# EAGLE design Track-Cam (EAGLE 7.7.0)
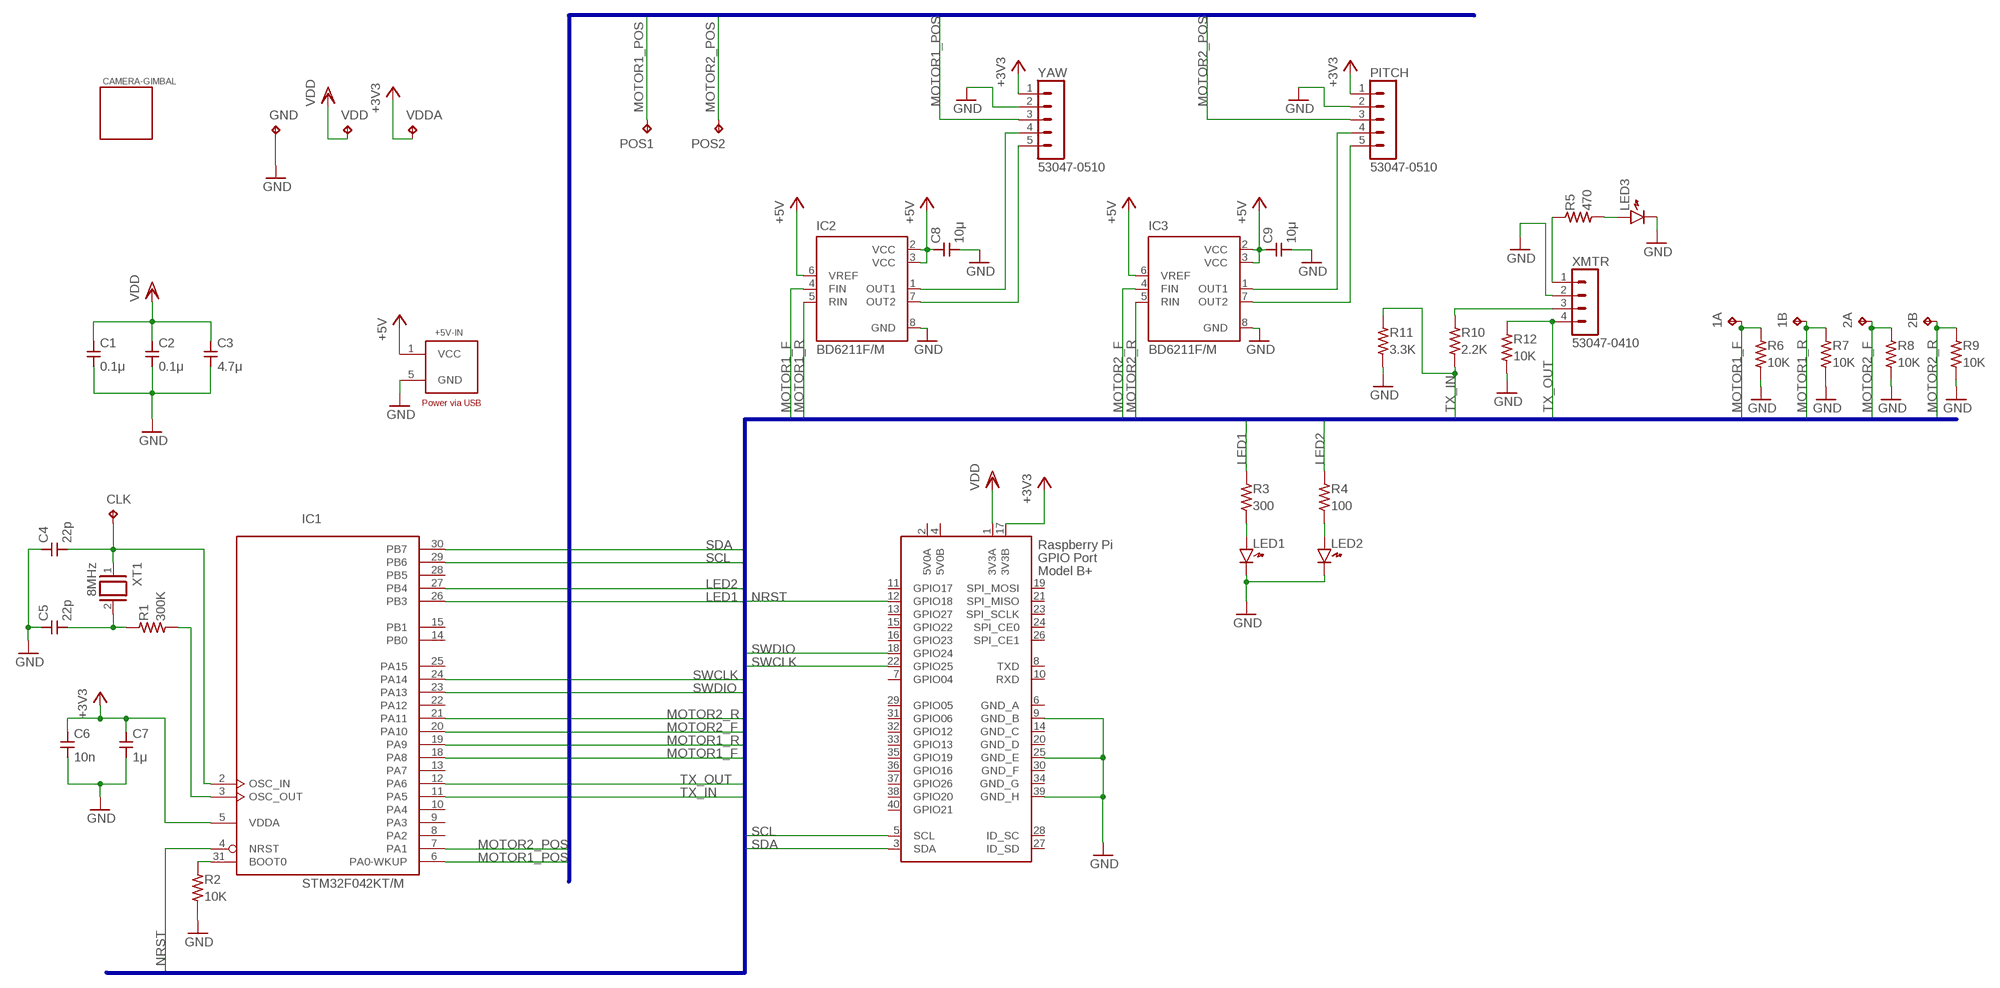
[diagram p0: schematic, sheet 1]

## Parts
1A  TPB1,27  [B1,27]
1B  TPB1,27  [B1,27]
2A  TPB1,27  [B1,27]
2B  TPB1,27  [B1,27]
+5V-IN  MRUSB-2B-D14NI-S306/M  [MICRO-USB-POWER/M]
C1  0.1μ  CAPACITOR2012  [SMD2012]
C2  0.1μ  CAPACITOR2012  [SMD2012]
C3  4.7μ  CAPACITOR2012  [SMD2012]
C4  22p  CAPACITOR1608  [SMD1608]
C5  22p  CAPACITOR1608  [SMD1608]
C6  10n  CAPACITOR2012  [SMD2012]
C7  1μ  CAPACITOR2012  [SMD2012]
C8  10μ  CAPACITOR2012  [SMD2012]
C9  10μ  CAPACITOR2012  [SMD2012]
CAMERA-GIMBAL  SG-90-CAMERA-MOUNT/NR  [SG90-CAMERA-MOUNT-NR]
CLK  TPB1,27  [B1,27]
GND  TPB1,27  [B1,27]
IC1  STM32F042KT/M  [LQFP32-M]
IC2  BD6211F/M  [SOP8/M]
IC3  BD6211F/M  [SOP8/M]
LED1  LED1608  [LED1608]
LED2  LED1608  [LED1608]
LED3  LED1608  [LED1608]
P1  RASPI_BOARD_B+#_HC  [RASPI_BOARD_B+HAT_CF]
PITCH  53047-0510  [53047-0510]
POS1  TPB1,27  [B1,27]
POS2  TPB1,27  [B1,27]
R1  300K  RESISTOR-US2012  [SMD2012]
R2  10K  RESISTOR-US2012  [SMD2012]
R3  300  RESISTOR-US2012  [SMD2012]
R4  100  RESISTOR-US2012  [SMD2012]
R5  470  RESISTOR-US2012  [SMD2012]
R6  10K  RESISTOR-US2012  [SMD2012]
R7  10K  RESISTOR-US2012  [SMD2012]
R8  10K  RESISTOR-US2012  [SMD2012]
R9  10K  RESISTOR-US2012  [SMD2012]
R10  2.2K  RESISTOR-US2012  [SMD2012]
R11  3.3K  RESISTOR-US2012  [SMD2012]
R12  10K  RESISTOR-US2012  [SMD2012]
VDD  TPB1,27  [B1,27]
VDDA  TPB1,27  [B1,27]
XMTR  53047-0410  [53047-0410]
XT1  8MHz  XTAL/S  [QS]
YAW  53047-0510  [53047-0510]

## Nets
+3V3 [power]: C6.1 C7.1 IC1.5(VDDA) P1.17(3V3B) PITCH.1 VDDA.TP YAW.1
+5V [power]: +5V-IN.1(VCC) C8.1 C9.1 IC2.2(VCC) IC2.3(VCC) IC2.6(VREF) IC3.2(VCC) IC3.3(VCC) IC3.6(VREF)
BOOT0: IC1.31(BOOT0) R2.1
GND [gnd]: +5V-IN.5(GND) C1.2 C2.2 C3.2 C4.1 C5.1 C6.2 C7.2 C8.2 C9.2 GND.TP IC2.8(GND) IC3.8(GND) LED1.K LED2.K LED3.K P1.9(GND_B) P1.25(GND_E) P1.39(GND_H) PITCH.2 R2.2 R6.2 R7.2 R8.2 R9.2 R11.2 R12.2 XMTR.2 YAW.2
LED1: IC1.26(PB3) R3.1
LED2: IC1.27(PB4) R4.1
MOTOR1+: IC2.1(OUT1) YAW.4
MOTOR1-: IC2.7(OUT2) YAW.5
MOTOR1_F: 1A.TP IC1.18(PA8) IC2.4(FIN) R6.1
MOTOR1_POS: IC1.6(PA0-WKUP) POS1.TP YAW.3
MOTOR1_R: 1B.TP IC1.19(PA9) IC2.5(RIN) R7.1
MOTOR2+: IC3.1(OUT1) PITCH.4
MOTOR2-: IC3.7(OUT2) PITCH.5
MOTOR2_F: 2A.TP IC1.20(PA10) IC3.4(FIN) R8.1
MOTOR2_POS: IC1.7(PA1) PITCH.3 POS2.TP
MOTOR2_R: 2B.TP IC1.21(PA11) IC3.5(RIN) R9.1
N$1: C5.2 R1.1 XT1.2
N$8: LED1.A R3.2
N$9: LED2.A R4.2
N$10: R5.1 XMTR.1
N$11: LED3.A R5.2
NRST: IC1.4(NRST) P1.12(GPIO18)
OSC_IN: C4.2 CLK.TP IC1.2(OSC_IN) XT1.1
OSC_OUT: IC1.3(OSC_OUT) R1.2
SCL: IC1.29(PB6) P1.5(SCL)
SDA: IC1.30(PB7) P1.3(SDA)
SWCLK: IC1.24(PA14) P1.22(GPIO25)
SWDIO: IC1.23(PA13) P1.18(GPIO24)
TX_IN: IC1.11(PA5) R10.2 R11.1
TX_IN_5V: R10.1 XMTR.3
TX_OUT: IC1.12(PA6) R12.1 XMTR.4
VDD [power]: C1.1 C2.1 C3.1 P1.1(3V3A) VDD.TP
Unconnected: IC1.8(PA2) IC1.9(PA3) IC1.10(PA4) IC1.13(PA7) IC1.14(PB0) IC1.15(PB1) IC1.22(PA12) IC1.25(PA15) IC1.28(PB5) P1.7(GPIO04) P1.8(TXD) P1.10(RXD) P1.11(GPIO17) P1.13(GPIO27) P1.15(GPIO22) P1.16(GPIO23) P1.19(SPI_MOSI) P1.21(SPI_MISO) P1.23(SPI_SCLK) P1.24(SPI_CE0) P1.26(SPI_CE1) P1.27(ID_SD) P1.28(ID_SC) P1.29(GPIO05) P1.31(GPIO06) P1.32(GPIO12) P1.33(GPIO13) P1.35(GPIO19) P1.36(GPIO16) P1.37(GPIO26) P1.38(GPIO20) P1.40(GPIO21)

## Buses
DIG[0..12]
ANA[0..1]

## Power pins joined to a net without a drawn wire
5V0A: P1.2(5V0A)
5V0B: P1.4(5V0B)
GND: IC1.16(GND) IC1.32(GND)
GND_A: P1.6(GND_A)
GND_C: P1.14(GND_C)
GND_D: P1.20(GND_D)
GND_F: P1.30(GND_F)
GND_G: P1.34(GND_G)
VDD: IC1.1(VDD) IC1.17(VDD)

## Library data of the parts
1A 1B 2A 2B CLK GND POS1 POS2 VDD VDDA = testpad:TP: Test pad
+5V-IN = connector:MRUSB-2B-D14NI-S306: Useconn Electronics Ltd. Micro USB, B type Female Solder type
C1-C9 = gen-discrete:CAPACITOR: Generic Capacitor
CAMERA-GIMBAL = mech:SG-90-CAMERA-MOUNT
IC1 = stm32:STM32F042K*T: ARM 32-bit Cortex™-M0 CPU 48 MHz maximum frequency 32 Kbytes of Flash memory 6 kbytes of SRAM 26 GPIOs 2.4 to 3.6 V application supply
IC2 IC3 = rohm-modified:BD621*F: H-bridge driver for brush motors Source: http://www.rohm.com/products/databook/motor/pdf/bd623x_series-e.pdf
LED1-LED3 = gen-discrete:LED: Generic LEDs
P1 = raspi:RASPI_BOARD_B+#: Raspberry Pi GPIO connector with markings for the outer dimensions of the Raspberry Pi board model B+ with different sets of drill holes or mounting pads All pins connected
PITCH YAW = connector:53047-0510: HEADER
R1-R12 = gen-discrete:RESISTOR-US: Generic Registor
XMTR = connector:53047-0410: HEADER
XT1 = gen-discrete:XTAL/S: CRYSTAL

## Net classes
1 gnd: width 0.61 mm, drill 0.203 mm
2 power: width 0.61 mm, drill 0.203 mm

## Board
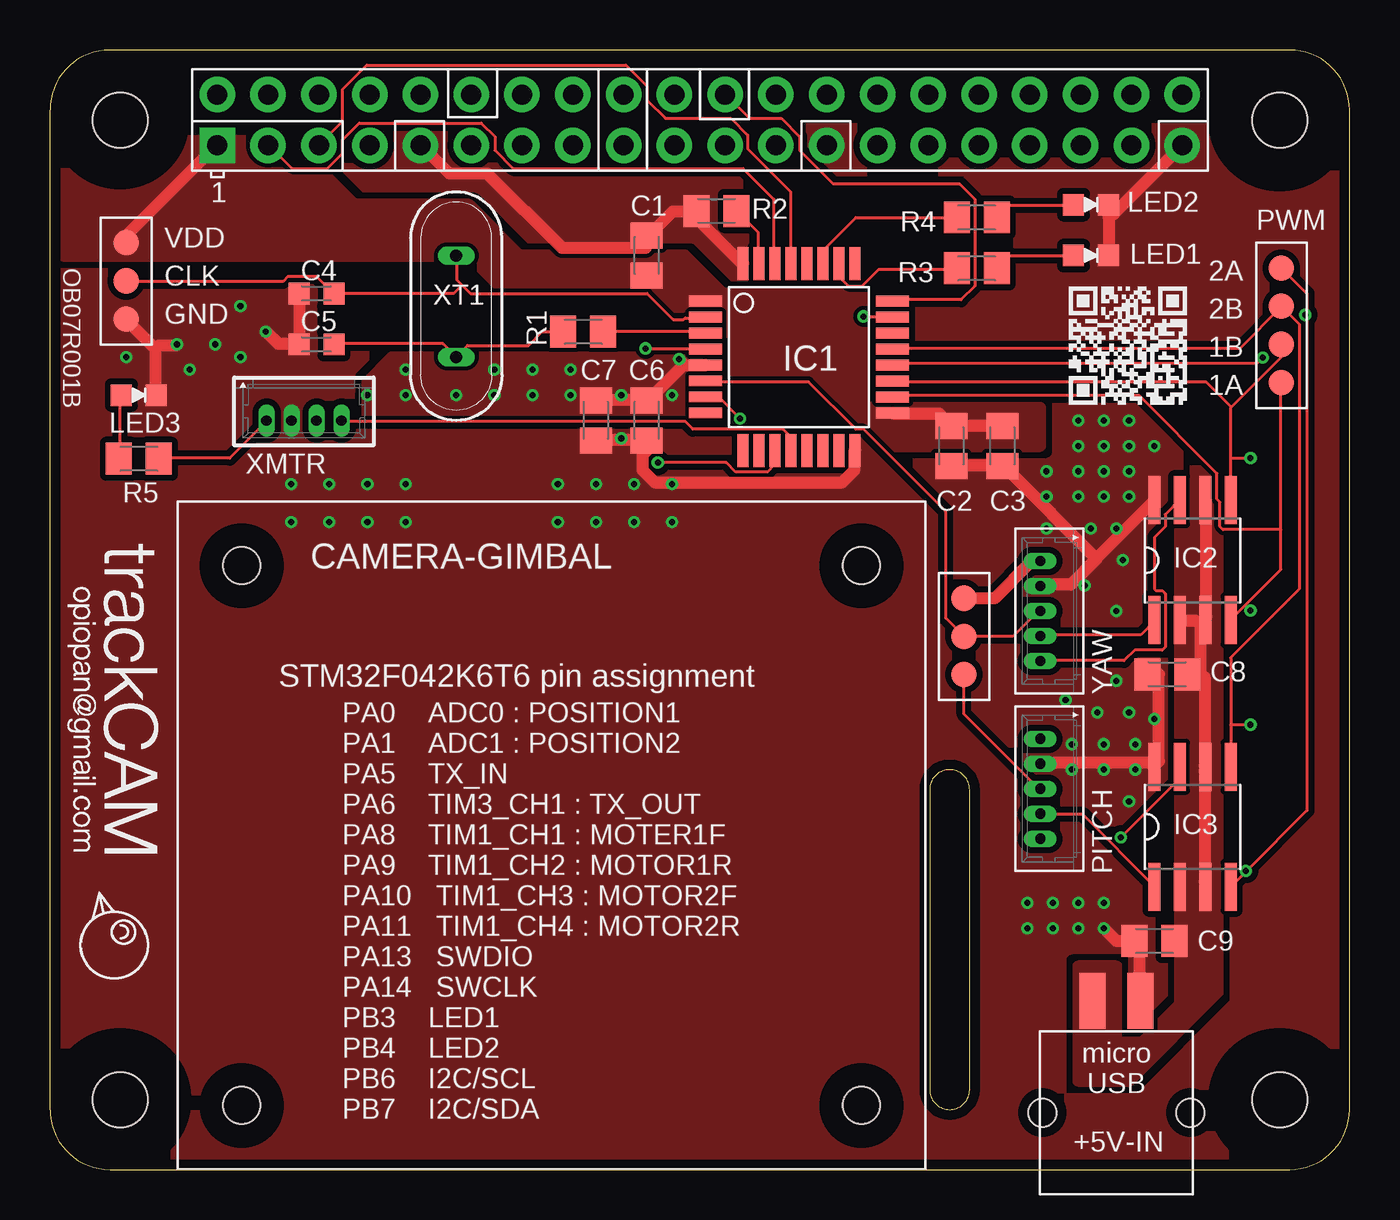
[diagram p1: board, top side]
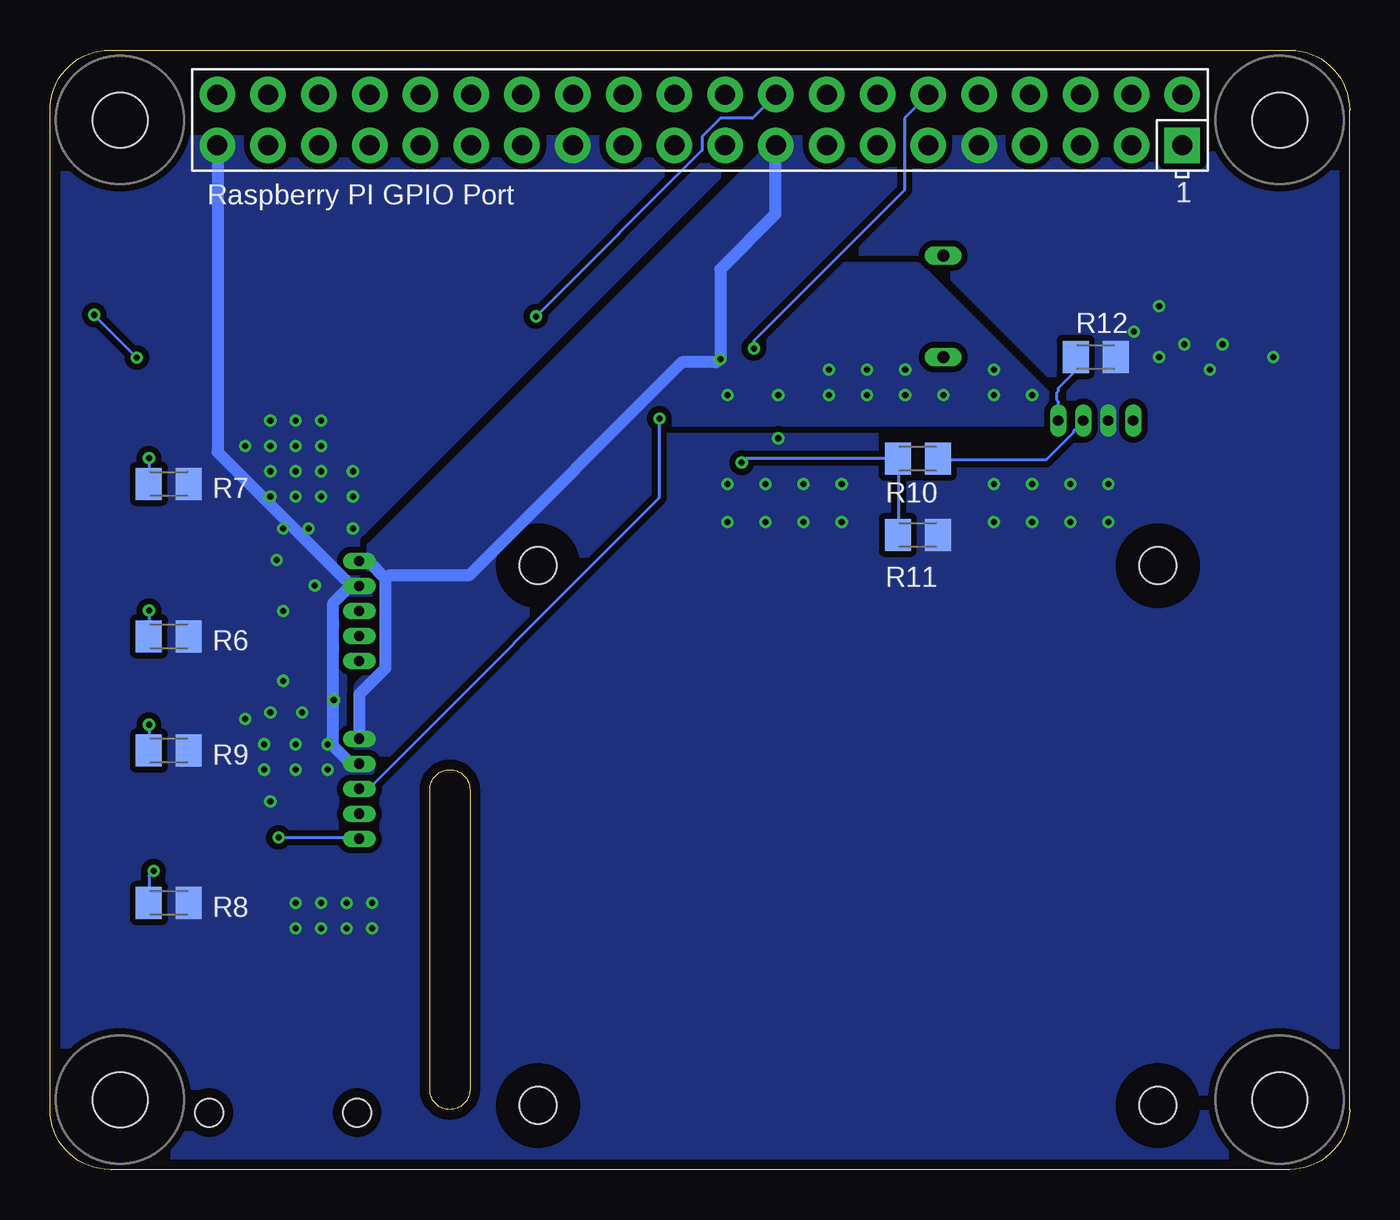
[diagram p2: board, bottom side, seen from below]

Size 65 x 56 mm. Coordinates in mm from the lower left corner, seen from the top.
Copper layers (1*16): Top 0.035mm / dielectric 1.6mm / Bottom 0.035mm
Design rules "Elecrow_2-layer_PCB_eagle_rule": minimum track width 6mil, minimum drill 12mil, track to track 6mil, track to pad 6mil, pad to pad 6mil, via to via 8mil, smd to smd 0mil, copper to edge 20mil, drill to drill 10mil, minimum pad ring 6mil, minimum via ring 6mil, stop-mask expansion 0mil, vias tented up to drill 100mil, thermal gap 10mil
tRestrict: area 13.7,41.9 to 14.9,43.2

### Footprints (pad centres in the part's own frame; a part is rotated, then mirrored left to right if it is on the bottom)
B1,27 = smd 1.27 x 1.27: TP 0,0
MICRO-USB-POWER/M = smd 1.3 x 2.8: 1 1.2,-2.1; 5 -1.2,-2.1 | hole 1.4: 3.7,3.5; -3.7,3.5
SMD2012 = smd 1.3 x 1.6: 1 -1,0; 2 1,0
SMD1608 = smd 1.05 x 1.08: 1 -0.875,0; 2 0.875,0
SG90-CAMERA-MOUNT-NR = hole 1.85: -15.5,13.5; 15.5,13.5; 15.5,-13.5; -15.5,-13.5
LQFP32-M = smd 0.54 x 1.65: 1 -2.8,-4.675; 2 -2,-4.675; 3 -1.2,-4.675; 4 -0.4,-4.675; 5 0.4,-4.675; 6 1.19,-4.675; 7 1.99,-4.675; 8 2.79,-4.675; 17 2.8,4.675; 18 2,4.675; 19 1.2,4.675; 20 0.4,4.675; 21 -0.4,4.675; 22 -1.2,4.675; 23 -2,4.675; 24 -2.8,4.675 | smd 1.65 x 0.54: 9 4.675,-2.8; 10 4.675,-2; 11 4.675,-1.2; 12 4.675,-0.4; 13 4.675,0.4; 14 4.675,1.2; 15 4.675,2; 16 4.675,2.8; 25 -4.675,2.8; 26 -4.675,2; 27 -4.675,1.2; 28 -4.675,0.4; 29 -4.675,-0.4; 30 -4.675,-1.2; 31 -4.675,-2; 32 -4.675,-2.8
SOP8/M = smd 0.6 x 2.4: 1 -1.905,-3; 2 -0.635,-3; 3 0.635,-3; 4 1.905,-3; 5 1.905,3; 6 0.635,3; 7 -0.635,3; 8 -1.905,3
LED1608 = smd 1.05 x 1.08: A -0.875,0; K 0.875,0
RASPI_BOARD_B+HAT_CF = drill 1 pad 1.778 square: 1 8.37,51.23 | drill 1 pad 1.778: 2 8.37,53.77; 3 10.91,51.23; 4 10.91,53.77; 5 13.45,51.23; 6 13.45,53.77; 7 15.99,51.23; 8 15.99,53.77; 9 18.53,51.23; 10 18.53,53.77; 11 21.07,51.23; 12 21.07,53.77; 13 23.61,51.23; 14 23.61,53.77; 15 26.15,51.23; 16 26.15,53.77; 17 28.69,51.23; 18 28.69,53.77; 19 31.23,51.23; 20 31.23,53.77; 21 33.77,51.23; 22 33.77,53.77; 23 36.31,51.23; 24 36.31,53.77; 25 38.85,51.23; 26 38.85,53.77; 27 41.39,51.23; 28 41.39,53.77; 29 43.93,51.23; 30 43.93,53.77; 31 46.47,51.23; 32 46.47,53.77; 33 49.01,51.23; 34 49.01,53.77; 35 51.55,51.23; 36 51.55,53.77; 37 54.09,51.23; 38 54.09,53.77; 39 56.63,51.23; 40 56.63,53.77 | hole 2.75: 3.5,3.5; 3.5,52.5; 61.5,3.5; 61.5,52.5
53047-0510 = drill 0.508 long: 1 2.5,0; 2 1.25,0; 3 0,0; 4 -1.25,0; 5 -2.5,0
53047-0410 = drill 0.508 long: 1 1.875,0; 2 0.625,0; 3 -0.625,0; 4 -1.875,0
QS = drill 0.61 long: 1 -2.54,0; 2 2.54,0

### Placement (x,y rotation side)
1A  61.59,39.37 0 top
1B  61.59,41.27 0 top
2A  61.59,45.09 0 top
2B  61.59,43.18 0 top
+5V-IN  53.34,6.35 180 top
C1  29.84,45.72 90 top
C2  45.09,36.2 270 top
C3  47.62,36.2 270 top
C4  13.34,43.81 0 top
C5  13.34,41.27 0 top
C6  29.84,37.47 270 top
C7  27.3,37.47 270 top
C8  55.88,24.77 180 top
C9  55.24,11.43 180 top
CAMERA-GIMBAL  25.08,16.7 0 top
CLK  3.81,44.45 0 top
GND  3.81,42.55 0 top
IC1  37.47,40.64 270 top
IC2  57.15,30.48 0 top
IC3  57.15,17.14 0 top
LED1  52.07,45.72 0 top
LED2  52.07,48.26 0 top
LED3  4.45,38.73 0 top
P1  0,0 0 top
PITCH  49.53,19.05 90 top
POS1  45.72,26.67 0 top
POS2  45.72,24.77 0 top
R1  26.67,41.91 0 top
R2  33.34,47.94 180 top
R3  46.35,45.09 0 top
R4  46.35,47.62 0 top
R5  4.45,35.56 180 top
R6  59.05,26.67 0 bottom
R7  59.05,34.29 0 bottom
R8  59.05,13.34 0 bottom
R9  59.05,20.95 0 bottom
R10  21.59,35.56 180 bottom
R11  21.59,31.75 0 bottom
R12  12.7,40.64 0 bottom
U$1  [OPIOPAN-LOGO]  0.95,13.97 270 top
U$2  [TRACKCAM-LOGO]  0.64,32.07 270 top
U$3  [TRACKCAM-QRCODE]  50.16,37.47 0 top
VDD  3.81,46.35 0 top
VDDA  45.72,28.57 0 top
XMTR  12.7,37.47 180 top
XT1  20.32,43.18 270 top
YAW  49.53,27.94 90 top

### Tracks (layer width: path | path; a pad name or v marks a point on that pad's centre or on a via)
+3V3  (via drill 0.3)
  Top 0.61: VDDA.TP 47.24,28.57 49.07,30.4 49.53,30.4 YAW.1 | C7.1 27.36,38.48 29.79,38.48 C6.1 30.1,38.63 31.7,40.23 | 31.7,40.23 32.77,40.23 IC1.5 | v31.47,40.54 31.55,40.46 31.7,40.23
  Bottom 0.61: PITCH.1 49.53,23.77 48.23,25.07 48.23,29.57 | 48.23,29.57 49.07,30.4 49.53,30.4 YAW.1 | P1.17 28.73,51.21 28.73,47.78 31.47,45.03 v31.47,40.54 31.7,40.39 33.38,40.39 44.04,29.72 48.01,29.72 48.23,29.57
  other vias: 15.88,38.73 17.78,40.01 17.78,38.73 20.32,38.73 22.23,38.73 22.23,40.01 24.13,40.01 24.13,38.73 26.04,38.73 26.04,40.01 28.57,38.73 31.11,38.73
  pour Bottom (isolate 0.305, no thermals): 28.57,51.44 48.9,31.11 48.9,24.77 49.53,24.13 49.53,20.95 47.62,20.95 34.92,33.66 34.92,37.47 13.97,37.47 21.59,45.09 26.67,45.09 22.86,48.9 22.86,51.44
  pour Top (isolate 0.203, no thermals): 32.38,40.64 32.38,37.47 15.88,37.47 15.88,39.37 17.14,40.64
+5V
  Top 0.61: 57.53,27.2 57.53,24.77 C8.1 | 57.53,27.2 57.76,27.43 IC2.3 57.84,27.74 57.84,33.45 IC2.6 | 57.76,24.61 57.76,20.19 IC3.6 57.76,19.89 57.76,14.4 IC3.3 | IC2.2 56.54,27.43 57.38,27.43 57.53,27.2
  pour Top (isolate 0.203, no thermals): 51.44,10.16 51.44,4.45 53.98,4.45 58.42,8.89 58.42,34.92 56.52,34.92 56.52,8.26 54.61,6.35 53.34,6.35 53.34,10.16
BOOT0
  Top 0.152: R2.1 34.37,47.93 35.43,46.86 35.43,45.34 IC1.31
GND  (via drill 0.3)
  Top 0.61: C2.2 45.11,35.2 C3.2 47.85,35.05 52.35,30.56 | 52.35,30.56 55.24,33.45 IC2.8 | 52.35,30.56 51.05,29.26 49.53,29.26 YAW.2 | PITCH.2 49.53,20.34 55.02,20.34 IC3.8 55.24,20.19 55.47,20.42 55.47,24.77 C8.2 | LED1.K 52.96,47.62 LED2.K 52.96,47.93 53.19,47.78 56.62,51.21 P1.39 | P1.9 18.59,51.21 19.96,49.84 21.87,49.84 25.6,46.1 29.79,46.1 C1.2 30.1,46.86 31.17,47.93 32.31,47.93 R2.2 32.31,47.62 34.59,45.34 IC1.32 | 28.57,36.5 29.79,36.5 C6.2 | 28.57,36.5 27.36,36.5 C7.2 | 5.26,41.07 5.26,38.79 LED3.K | 5.26,41.07 3.81,42.52 GND.TP | 40.23,35.89 IC1.16 40.23,35.59 40.23,34.98 39.62,34.37 30.25,34.37 29.64,34.98 29.64,35.74 29.87,35.97 C6.2 | 30.02,36.2 C6.2 | v10.79,41.91 10.82,41.91 11.43,41.3 12.42,41.3 C5.1 12.5,41.6 12.5,43.81 C4.1 | v52.7,12.06 53.34,11.43 C9.2 54.48,11.28 54.48,8.46 +5V-IN.5 | 5.26,41.07 5.49,41.22 6.33,41.22 v6.35,41.27 | v28.57,36.58 28.57,36.5
  Bottom 0.61: PITCH.2 50.14,20.5 50.83,21.18 50.83,28.35 49.99,29.18 YAW.2 50.14,29.41 56.62,35.89 56.62,51.21 P1.39 | v28.57,36.58 28.57,36.55
  other vias: 53.98,36.2 51.44,37.47 52.7,37.47 53.98,37.47 55.24,36.2 52.7,36.2 51.44,36.2 53.98,34.92 53.98,33.66 49.85,32.07 53.66,30.48 53.34,32.07 52.07,32.07 52.7,33.66 52.7,34.92 51.44,34.92 51.44,33.66 49.85,33.66 49.85,34.92 51.75,29.21 53.34,27.94 53.34,24.45 50.8,23.5 52.39,22.86 53.98,22.86 55.24,22.54 54.29,21.27 52.7,21.27 51.12,21.27 54.29,20 52.7,20 51.12,20 53.98,18.41 8.26,41.27 9.53,40.64 48.9,13.34 50.16,13.34 51.44,13.34 52.7,13.34 51.44,12.06 50.16,12.06 48.9,12.06 6.99,40.01 3.81,40.64 9.53,43.18 12.06,34.29 12.06,32.38 13.97,34.29 13.97,32.38 15.88,34.29 15.88,32.38 17.78,34.29 17.78,32.38 25.4,34.29 25.4,32.38 27.3,32.38 27.3,34.29 29.21,34.29 29.21,32.38 31.11,32.38 31.11,34.29
  pour Bottom (isolate 0.305, rank 6, no thermals): -0.64,51.44 65.41,51.44 65.41,-0.64 -0.64,-0.64
  pour Top (isolate 0.305, rank 6, no thermals): 0,52.07 64.77,52.07 64.77,0 0,0
LED1
  Top 0.152: R3.1 45.34,45.03 41.45,45.03 40.62,44.2 39.93,44.2 39.47,44.65 39.47,45.26 IC1.26
LED2
  Top 0.152: R4.1 40.31,47.62 38.71,46.02 38.71,45.34 IC1.27
MOTOR1+
  Top 0.152: YAW.4 49.53,26.75 54.56,26.75 55.24,27.43 IC2.1
MOTOR1-
  Top 0.152: YAW.5 49.53,25.45 53.72,25.45 54.25,25.98 55.63,25.98 55.78,26.14 55.78,28.8 55.63,28.96 55.32,28.96 55.24,29.03 55.24,31.62 55.78,32.16 55.78,32.77 56.46,33.45 IC2.7
MOTOR1_F  (via drill 0.3)
  Top 0.152: 61.57,32 61.57,30.02 59.78,28.23 | 61.57,32 61.57,39.32 1A.TP | 59.78,28.23 59.05,27.51 IC2.4 | 61.57,32 58.67,32 58.52,32.16 58.52,33.38 58.37,33.53 58.37,34.82 54.48,38.71 42.22,38.71 IC1.18 | 59.78,28.23 v60.05,27.96
  Bottom 0.152: v60.05,27.96 R6.1
MOTOR1_POS
  Top 0.152: YAW.3 49.53,27.89 49.38,27.89 48.16,26.67 POS1.TP 44.81,27.58 44.81,32.92 40.69,37.03 40.31,37.03 37.95,39.4 32.84,39.4 IC1.6
MOTOR1_R  (via drill 0.3)
  Top 0.152: 59.09,38.14 59.05,38.1 59.05,35.59 | 59.09,38.14 61.57,40.62 61.57,41.22 1B.TP | IC2.5 59.05,35.59 | 59.09,38.14 57.84,39.4 42.22,39.4 IC1.19 | 59.05,35.59 v60.05,35.59
  Bottom 0.152: v60.05,35.59 R7.1
MOTOR2+
  Top 0.152: PITCH.4 49.53,17.75 51.66,17.75 55.24,14.17 IC3.1
MOTOR2-  (via drill 0.3)
  Top 0.152: v53.57,16.61 56.46,19.51 56.46,20.12 IC3.7
  Bottom 0.152: v53.57,16.61 49.53,16.61 PITCH.5
MOTOR2_F  (via drill 0.3)
  Top 0.152: 2A.TP 62.87,43.81 62.87,42.75 | 62.87,42.75 62.87,17.95 59.83,14.92 | 59.83,14.92 IC3.4 | v60.66,40.62 60.35,40.31 42.22,40.31 IC1.20 | 62.87,42.75 v62.79,42.75 | v59.82,14.94 59.83,14.92
  Bottom 0.152: v62.79,42.75 v60.66,40.62 | v59.82,14.94 60.05,14.71 R8.1
MOTOR2_POS  (via drill 0.3)
  Top 0.152: POS2.TP 45.72,22.78 49.45,19.05 PITCH.3 | v34.52,37.57 33.45,38.63 32.84,38.63 IC1.7
  Bottom 0.152: v34.52,37.57 34.52,33.6 49.07,19.05 PITCH.3
MOTOR2_R  (via drill 0.3)
  Top 0.152: 59.05,22.25 59.05,25.6 62.48,29.03 62.48,42.29 2B.TP 61.57,43.13 59.51,41.07 42.22,41.07 IC1.21 | 59.05,22.25 IC3.5 | 59.05,22.25 v60.05,22.25
  Bottom 0.152: v60.05,22.25 R9.1
N$1
  Top 0.152: C5.2 14.25,41.3 19.66,41.3 XT1.2 20.34,40.69 20.88,41.22 23.93,41.22 24.61,41.91 R1.1
N$8
  Top 0.152: LED1.A 48.01,45.72 47.4,45.11 R3.2
N$9
  Top 0.152: R4.2 47.4,47.62 48.01,48.23 51.13,48.23 LED2.A
N$10
  Top 0.152: R5.1 5.49,35.59 8.99,35.59 10.82,37.41 XMTR.1
N$11
  Top 0.152: LED3.A 3.5,38.71 3.5,35.59 R5.2
NRST  (via drill 0.3)
  Top 0.152: v29.79,41.07 32.77,41.07 IC1.4
  Bottom 0.152: v29.79,41.07 29.79,41.45 22.25,49 22.25,52.58 21.11,53.72 P1.12
OSC_IN
  Top 0.152: CLK.TP 3.81,44.42 11.66,44.42 11.89,44.65 13.34,44.65 14.17,43.81 C4.2 20.19,43.81 20.61,44.23 | 20.61,44.23 20.34,44.5 20.34,45.72 XT1.1 | 20.61,44.23 21.03,43.81 29.87,43.81 31.17,42.52 31.7,42.52 31.77,42.6 32.77,42.6 IC1.2
OSC_OUT
  Top 0.152: 32.77,41.83 IC1.3 32.77,41.91 R1.2
SCL
  Top 0.152: IC1.29 37.03,45.34 37.03,48.92 34.9,51.05 34.9,51.74 34.06,52.58 30.79,52.58 29.87,53.49 29.87,54.18 28.8,55.24 15.85,55.24 14.63,54.03 14.63,52.43 13.49,51.28 P1.5
SDA
  Top 0.152: IC1.30 36.2,45.34 36.2,48.54 34.67,50.06 23.16,50.06 22.25,50.98 22.25,51.66 21.57,52.35 15.47,52.35 14.63,51.51 14.63,50.83 13.87,50.06 12.12,50.06 10.97,51.21 P1.3
SWCLK
  Top 0.152: IC1.24 42.22,43.51 45.57,43.51 46.25,44.2 46.25,48.54 45.49,49.3 39.17,49.3 37.49,50.98 37.49,51.66 36.58,52.58 34.98,52.58 33.83,53.72 P1.22
SWDIO  (via drill 0.3)
  Top 0.152: v40.69,42.67 42.14,42.67 IC1.23
  Bottom 0.152: v40.69,42.67 32.38,50.98 32.38,51.66 31.47,52.58 29.87,52.58 28.73,53.72 P1.18
TX_IN  (via drill 0.3)
  Top 0.152: v30.4,35.36 33.83,35.36 34.29,34.9 35.89,34.9 36.2,35.2 36.2,35.89 IC1.11
  Bottom 0.152: v30.4,35.36 30.18,35.59 22.63,35.59 R10.2 | 22.55,35.51 R10.2 | R11.1 22.55,31.77 22.55,35.43 R10.2
TX_IN_5V
  Bottom 0.152: 20.57,35.51 R10.1 20.5,35.51 15.16,35.51 13.79,36.88 13.79,36.96 13.34,37.41 XMTR.3
TX_OUT
  Top 0.152: XMTR.4 14.63,37.41 31.77,37.41 32.16,37.03 36.65,37.03 37.03,36.65 37.03,35.97 IC1.12
  Bottom 0.152: R12.1 13.72,40.62 13.72,39.93 14.55,39.09 14.55,38.94 14.63,38.86 14.63,38.48 14.55,38.41 14.55,37.49 XMTR.4
VDD
  Top 0.61: C3.1 47.62,37.19 45.11,37.19 C2.1 44.88,37.41 44.5,37.8 42.22,37.8 IC1.17 | VDD.TP 3.81,46.71 8.31,51.21 P1.1
  pour Top (isolate 0.203, no thermals): 12.06,51.44 6.35,51.44 0.64,50.8 0.64,45.72 20.95,45.72 22.86,43.81 28.57,43.81 30.48,41.91 34.29,41.91 34.29,39.37 37.47,39.37 40.64,36.2 49.53,36.2 49.53,38.1 40.64,38.1 40.64,43.81 33.66,43.81 31.75,45.72 23.5,45.72 20.95,48.26 15.24,48.26

### Text on the board
tPlace: PWM | OB07R001B | STM32F042K6T6 pin assignment | PA0 ADC0 : POSITION1 / PA1 ADC1 : POSITION2 / PA5 TX_IN / PA6 TIM3_CH1 : TX_OUT / PA8 TIM1_CH1 : MOTER1F / PA9 TIM1_CH2 : MOTOR1R / PA10 TIM1_CH3 : MOTOR2F / PA11 TIM1_CH4 : MOTOR2R / PA13 SWDIO / PA14 SWCLK / PB3 LED1 / PB4 LED2 / PB6 I2C/SCL / PB7 I2C/SDA